# EAGLE schematic Inverter - IGBT (EAGLE 6.2)

## Sheet 1 of 2: Power Supply
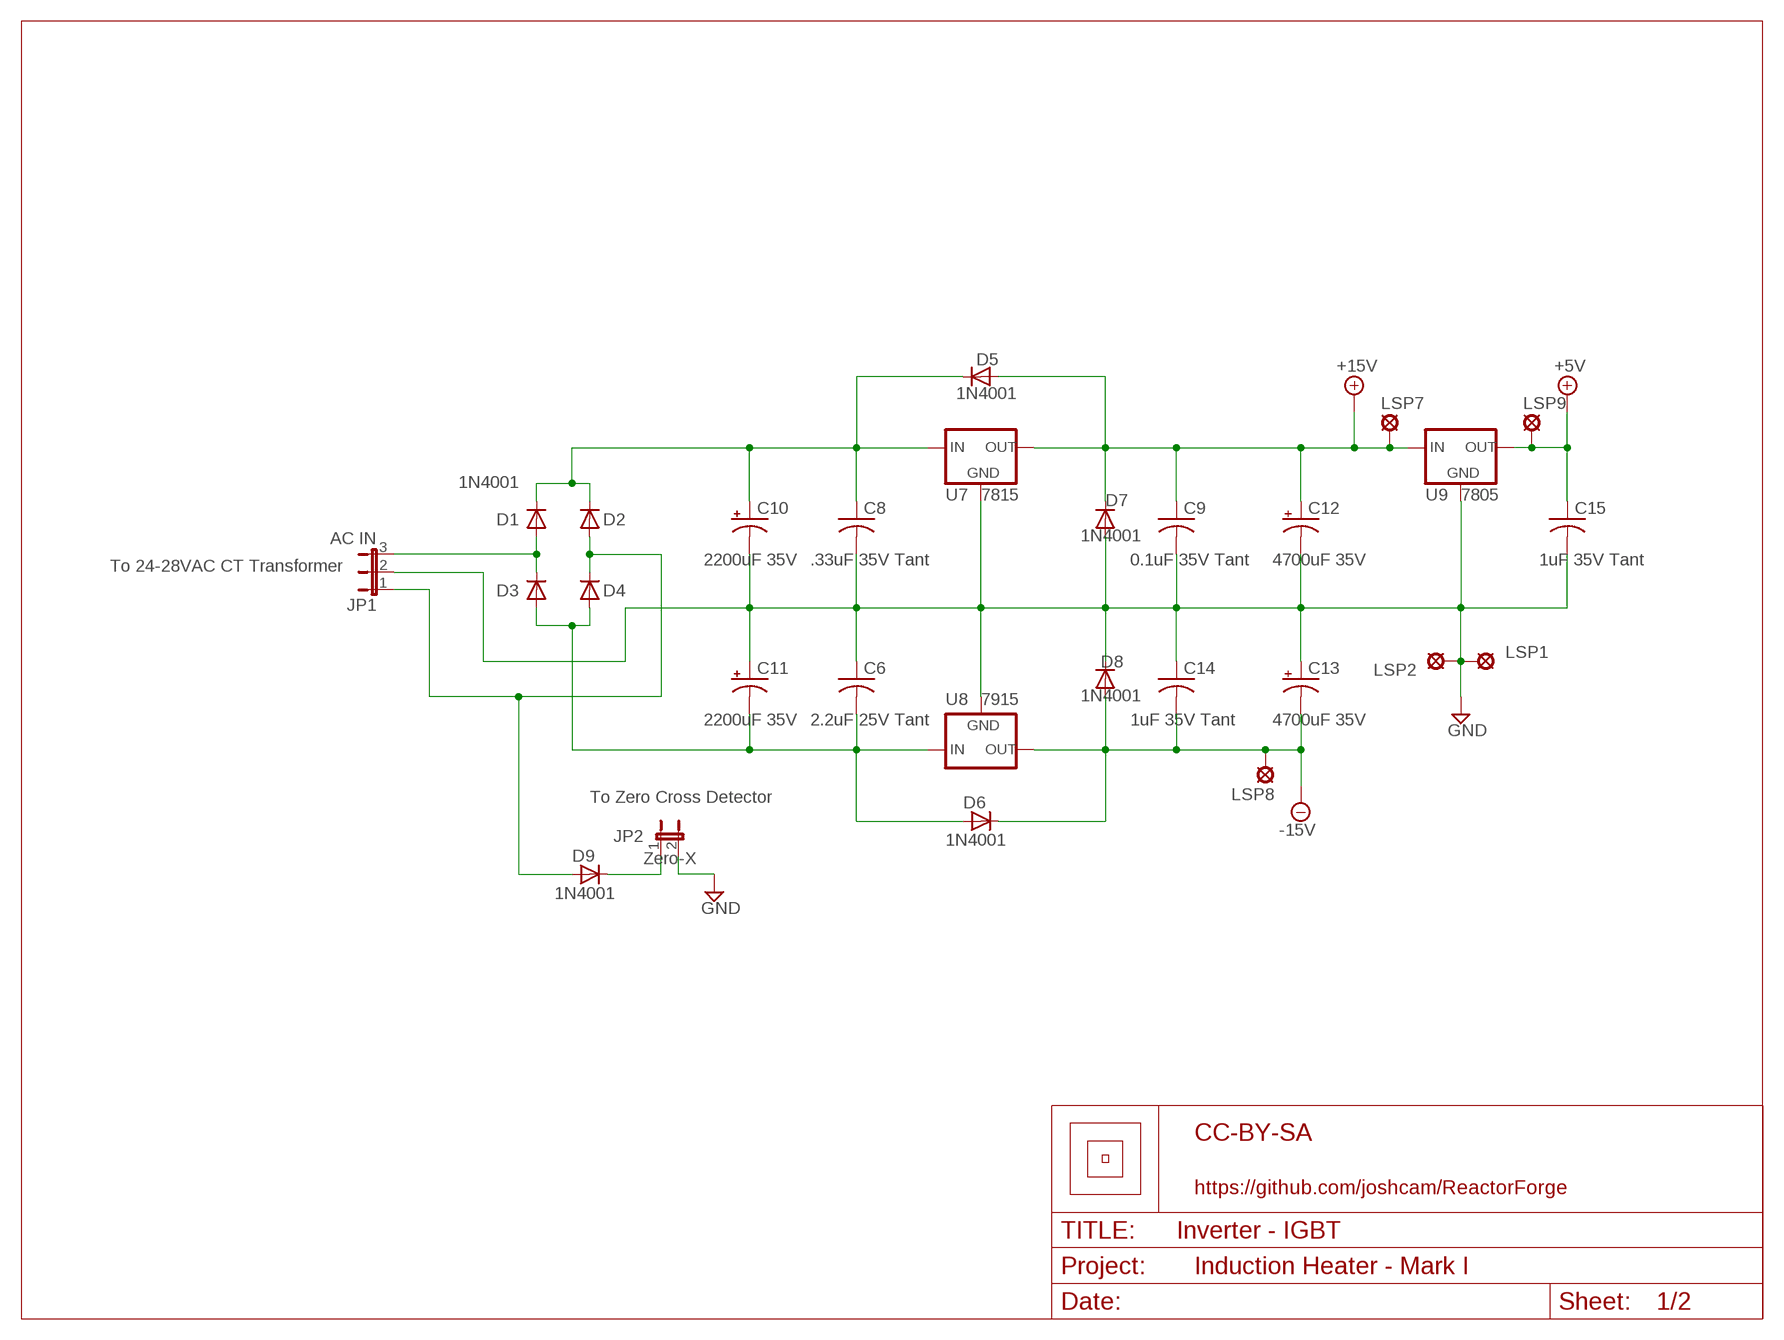
[diagram p0: schematic, sheet 1]
U$2 (LETTER_L): LICENSE: CC-BY-SA; PROJECT: Induction Heater - Mark I; URL: https://github.com/joshcam/ReactorForge

### Parts
C6  2.2uF 25V Tant  C-USC1206  [C1206]
C8  .33uF 35V Tant  C-USC1206  [C1206]
C9  0.1uF 35V Tant  C-USC1206  [C1206]
C10  2200uF 35V  CPOL-USE7.5-18  [E7,5-18]
C11  2200uF 35V  CPOL-USE7.5-18  [E7,5-18]
C12  4700uF 35V  CPOL-USE7.5-18  [E7,5-18]
C13  4700uF 35V  CPOL-USE7.5-18  [E7,5-18]
C14  1uF 35V Tant  C-USC1206  [C1206]
C15  1uF 35V Tant  C-USC1206  [C1206]
D1  1N4001  [DIODE.4-AXIAL]
D2  1N4001  [DIODE.4-AXIAL]
D3  1N4001  [DIODE.4-AXIAL]
D4  1N4001  [DIODE.4-AXIAL]
D5  1N4001  [DIODE.4-AXIAL]
D6  1N4001  [DIODE.4-AXIAL]
D7  1N4001  [DIODE.4-AXIAL]
D8  1N4001  [DIODE.4-AXIAL]
D9  1N4001  [DIODE.4-AXIAL]
JP1  AC IN  JP2E  [JP2]
JP2  Zero-X  JP1E  [JP1]
LSP1  SE14  [SE14]
LSP2  SE14  [SE14]
LSP7  SE14  [SE14]
LSP8  SE14  [SE14]
LSP9  SE14  [SE14]
U7  7815  78XXS  [78XXS]
U8  7915  79XXS  [79XXS]
U9  7805  78XXS  [78XXS]

### Nets
+5V: C15.1 LSP9.MP U9.OUT
+15V: C9.1 C12.+ D5.A D7.C LSP7.MP U7.OUT U9.IN ; also sheet 2
-15V: C13.- C14.2 D6.C D8.A LSP8.MP U8.OUT
GND: C6.1 C8.2 C9.2 C10.- C11.+ C12.- C13.+ C14.1 C15.2 D7.A D8.C JP1.2 JP2.2 LSP1.MP LSP2.MP U7.GND U8.GND U9.GND ; also sheet 2
N$10: C8.1 C10.+ D1.C D2.C D5.C U7.IN
N$12: D2.A D4.C D9.A JP1.1
N$16: D1.A D3.C JP1.3
N$17: C6.2 C11.- D3.A D4.A D6.A U8.IN
N$18: D9.C JP2.1

### Notes on the sheet
- To 24-28VAC CT Transformer
- To Zero Cross Detector

## Sheet 2 of 2: Inverter
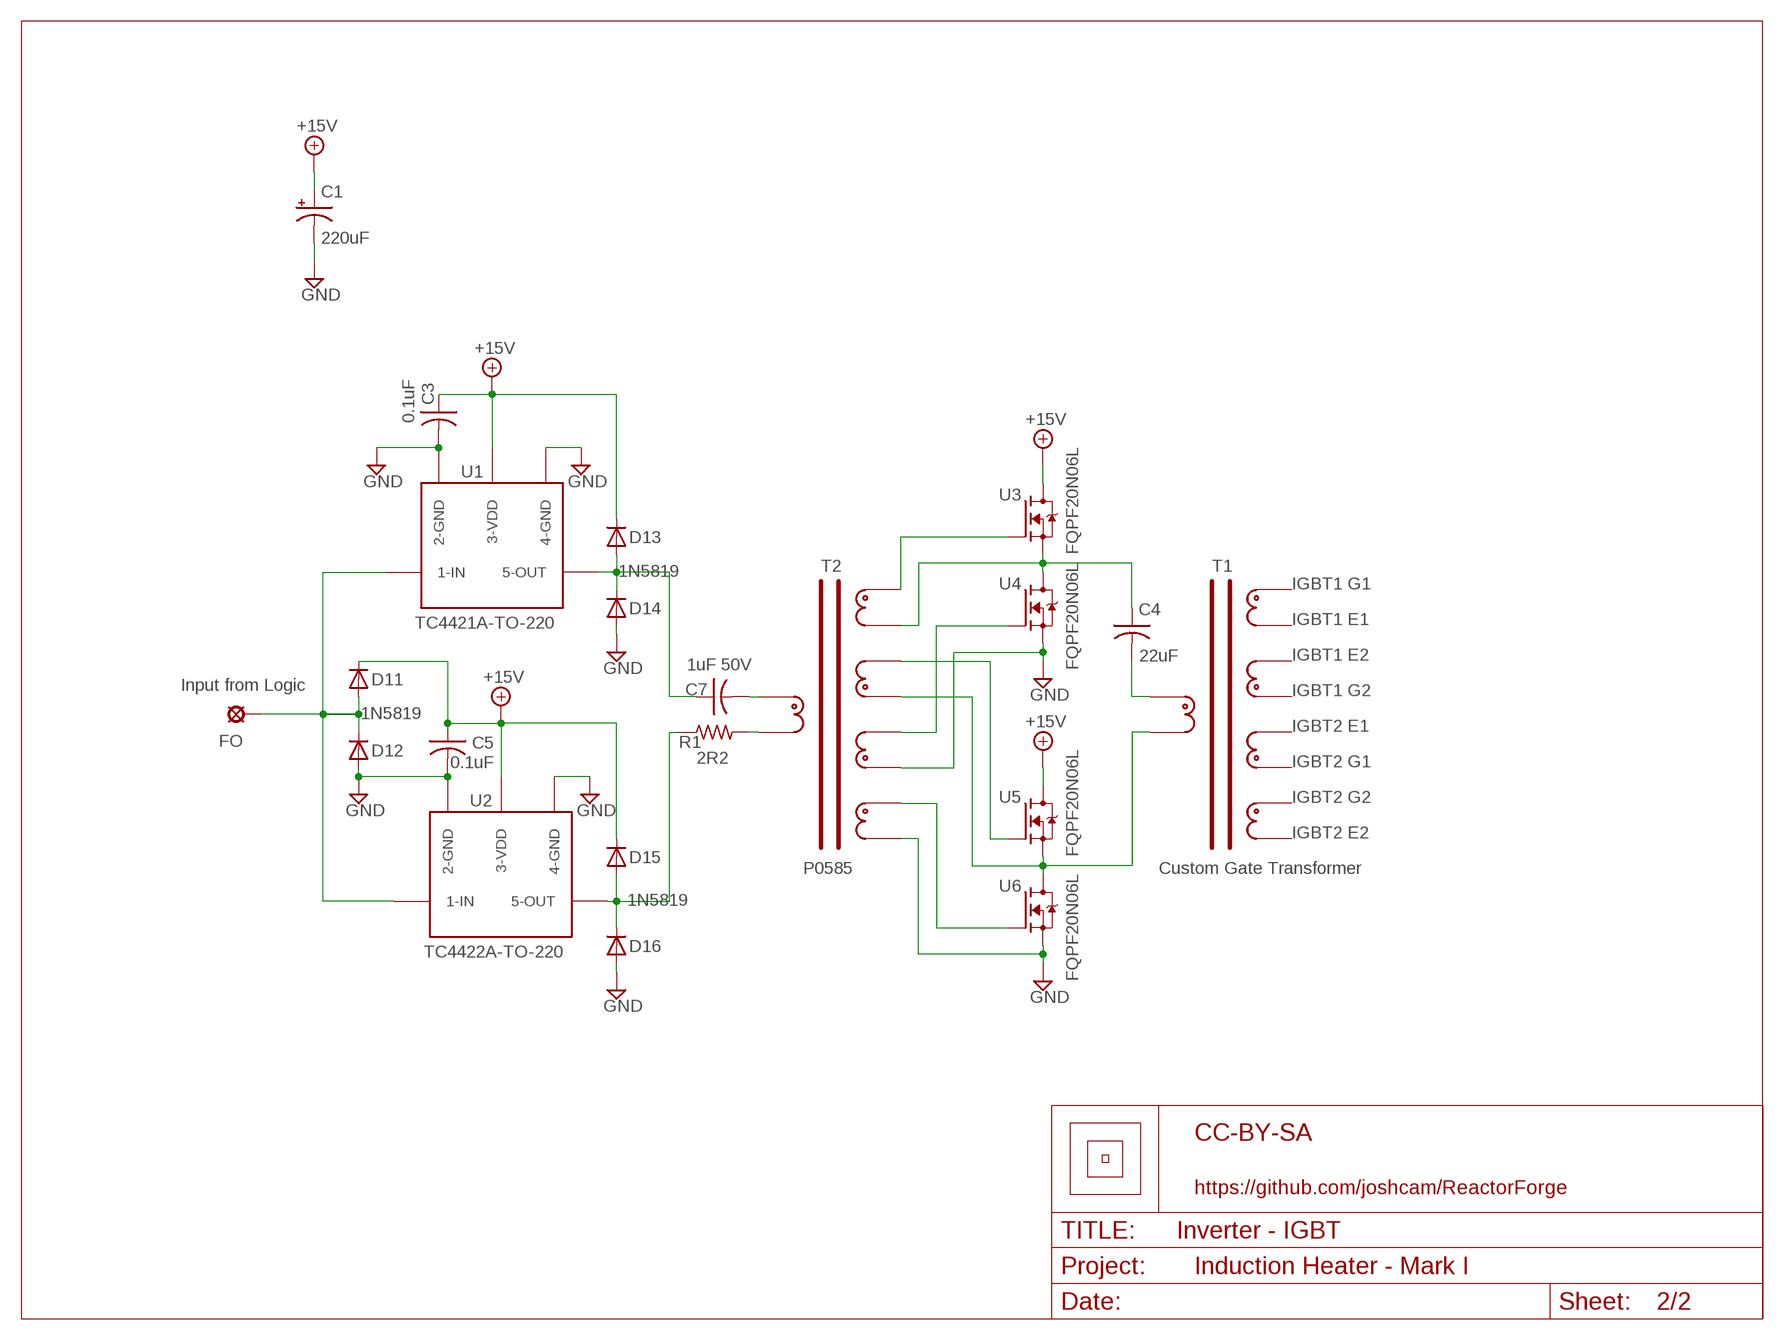
[diagram p1: schematic, sheet 2]
U$1 (LETTER_L): LICENSE: CC-BY-SA; PROJECT: Induction Heater - Mark I; URL: https://github.com/joshcam/ReactorForge

### Parts
C1  220uF  CPOL-USE5-10.5  [E5-10,5]
C3  0.1uF  C-USC1206  [C1206]
C4  22uF  C-USC1206  [C1206]
C5  0.1uF  C-USC1206  [C1206]
C7  1uF 50V  C-USC1206  [C1206]
D11  1N5819  [DIODE.4-AXIAL]
D12  1N5819  [DIODE.4-AXIAL]
D13  1N5819  [DIODE.4-AXIAL]
D14  1N5819  [DIODE.4-AXIAL]
D15  1N5819  [DIODE.4-AXIAL]
D16  1N5819  [DIODE.4-AXIAL]
FO  SE14  [SE14]
R1  2R2  R-US_0207/10  [0207/10]
T1  Custom Gate Transformer  P0585  [P0585]
T2  P0585  [P0585]
U1  TC4421A-TO-220  [TO-220-8TAB-H]
U2  TC4422A-TO-220  [TO-220-8TAB-H]
U3  FQPF20N06L  [TO-220-V]
U4  FQPF20N06L  [TO-220-V]
U5  FQPF20N06L  [TO-220-V]
U6  FQPF20N06L  [TO-220-V]

### Nets
+15V: C1.+ C3.1 C5.1 D11.C D13.C D15.C U1.3(3-VDD) U1.TAB(3-VDD) U2.3(3-VDD) U2.TAB(3-VDD) U3.2(D) U5.2(D) ; also sheet 1
FO: D11.A D12.C FO.MP U1.1(1-IN) U2.1(1-IN)
GND: T2.P$6 T2.P$9 U4.3(S) U6.3(S) ; also sheet 1
GND1: C1.- C3.2 C5.2 D12.A D14.A D16.A U1.2(2-GND) U1.4(4-GND) U2.2(2-GND) U2.4(4-GND) ; supply symbol labelled GND
N$2: C7.1 D13.A D14.C U1.5(5-OUT)
N$3: C7.2 T2.P$1
N$4: R1.2 T2.P$10
N$5: D15.A D16.C U2.5(5-OUT)
N$6: R1.1
N$7: C4.1 T2.P$3 U3.3(S) U4.2(D)
N$8: T1.P$10 T2.P$4 U5.3(S) U6.2(D)
N$9: T2.P$2 U3.1(G)
N$11: T2.P$8 U4.1(G)
N$13: T2.P$5 U5.1(G)
N$14: T2.P$7 U6.1(G)
N$15: C4.2 T1.P$1
Unconnected: T1.P$2 T1.P$3 T1.P$4 T1.P$5 T1.P$6 T1.P$7 T1.P$8 T1.P$9

### Notes on the sheet
- IGBT1 G1
- IGBT1 E1
- IGBT1 E2
- Input from Logic
- IGBT1 G2
- IGBT2 E1
- IGBT2 G1
- IGBT2 G2
- IGBT2 E2

## Library data of the parts
C1 = rcl:CPOL-US: POLARIZED CAPACITOR, American symbol
C3-C9 C14 C15 = resistor:C-US: CAPACITOR, American symbol
C10-C13 = resistor:CPOL-US: POLARIZED CAPACITOR, American symbol
D1-D9 = 1-Custom:1N4001: 1N4001 General Purpose Rectifier Diode
D11-D16 = 1-Custom:1N5819: 1N5819 Schottky Diode - 40V 1A
FO LSP1 LSP2 LSP7-LSP9 = solpad:SE14: SOLDER PAD E1553, drill 1,4mm, distributor Buerklin, 07F820
JP1 = jumper:JP2E: JUMPER
JP2 = jumper:JP1E: JUMPER
R1 = rcl:R-US_: RESISTOR, American symbol
T1 T2 = 1-Custom:P0585: P0585NL 1:1:1:1 Offline Gate Drive Transformer 50-500KHz
U1 = 1-Custom:TC4421A-TO-220: TC4421A 10A High-Speed MOSFET Driver - Inverting
U2 = 1-Custom:TC4422A-TO-220: TC4422A 10A High-Speed MOSFET Driver - Non-Inverting
U3-U6 = 1-Custom:FQPF20N06L: FQPF20N06L 60V LOGIC N-Channel MOSFET 30W Max
U7 U9 = v-reg:78XXS: VOLTAGE REGULATOR
U8 = v-reg:79XXS: VOLTAGE REGULATOR